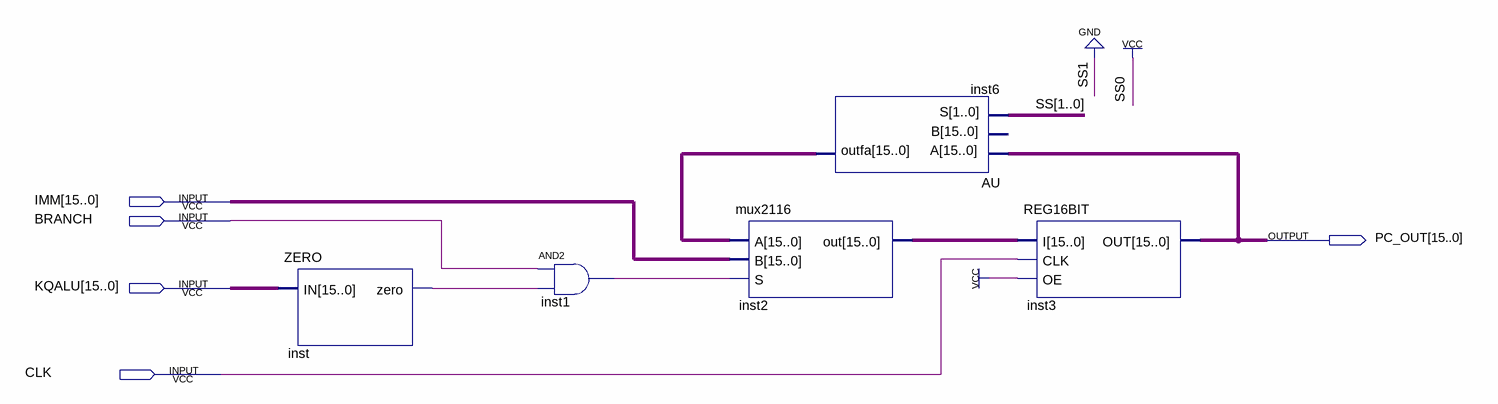
[diagram p0: schematic sheet]
// Quartus schematic PC.bdf as structural Verilog: 5 symbols, 5 pins
module PC (
  input  [15:0] IMM,
  input  BRANCH,
  input  [15:0] KQALU,
  input  CLK,
  output [15:0] PC_OUT
);

  wire inst1_out, inst_zero;
  wire [15:0] inst2_out, inst6_outfa;

  ZERO inst (.IN(KQALU), .zero(inst_zero));
  and inst1 (inst1_out, BRANCH, inst_zero);
  mux2116 inst2 (.A(inst6_outfa), .B(IMM), .S(inst1_out), .out(inst2_out));
  AU inst6 (.A(PC_OUT), .S(2'b01), .outfa(inst6_outfa));  // open: B
  REG16BIT inst3 (.I(inst2_out), .CLK(CLK), .OE(1'b1), .OUT(PC_OUT));
endmodule
